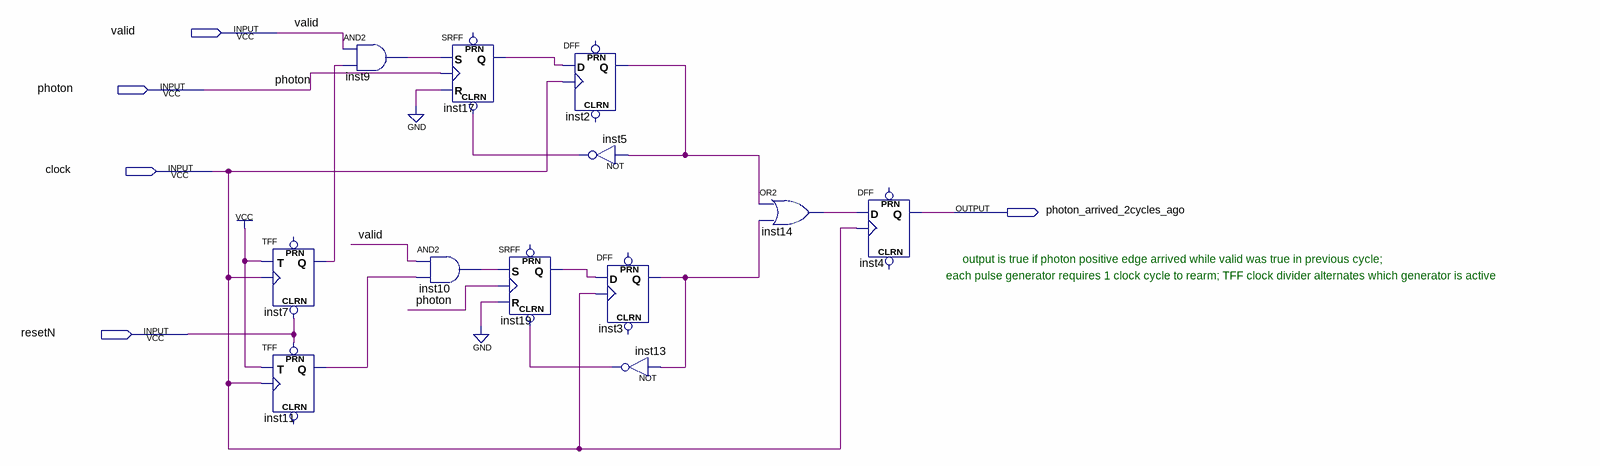
[diagram p0: schematic sheet]
// Quartus schematic edge_coincidence_pulse.bdf as structural Verilog: 12 symbols, 5 pins
module edge_coincidence_pulse (
  input  valid,
  input  photon,
  input  clock,
  input  resetN,
  output photon_arrived_2cycles_ago
);

  wire inst2_q, inst3_q, inst5_out, inst7_q, inst9_out, inst10_out, inst11_q, inst13_out, inst14_out,
       inst17_q, inst19_q;

  TFF inst7 (.CLRN(resetN), .T(1'b1), .CLK(clock), .Q(inst7_q));  // open: PRN
  TFF inst11 (.PRN(resetN), .T(1'b1), .CLK(clock), .Q(inst11_q));  // open: CLRN
  and inst9 (inst9_out, valid, inst7_q);
  SRFF inst17 (.CLRN(inst5_out), .S(inst9_out), .R(1'b0), .CLK(photon), .Q(inst17_q));  // open: PRN
  and inst10 (inst10_out, valid, inst11_q);
  SRFF inst19 (.CLRN(inst13_out), .S(inst10_out), .R(1'b0), .CLK(photon), .Q(inst19_q));  // open: PRN
  DFF inst2 (.CLK(clock), .D(inst17_q), .Q(inst2_q));  // open: CLRN, PRN
  not inst5 (inst5_out, inst2_q);
  DFF inst3 (.CLK(clock), .D(inst19_q), .Q(inst3_q));  // open: CLRN, PRN
  not inst13 (inst13_out, inst3_q);
  or inst14 (inst14_out, inst2_q, inst3_q);
  DFF inst4 (.CLK(clock), .D(inst14_out), .Q(photon_arrived_2cycles_ago));  // open: CLRN, PRN

  // Notes on the sheet:
  //   output is true if photon positive edge arrived while valid was true in previous cycle;
  //   each pulse generator requires 1 clock cycle to rearm; TFF clock divider alternates which generator is active
endmodule
